# Altium schematic sheet Sheet1.SchDoc
size A2
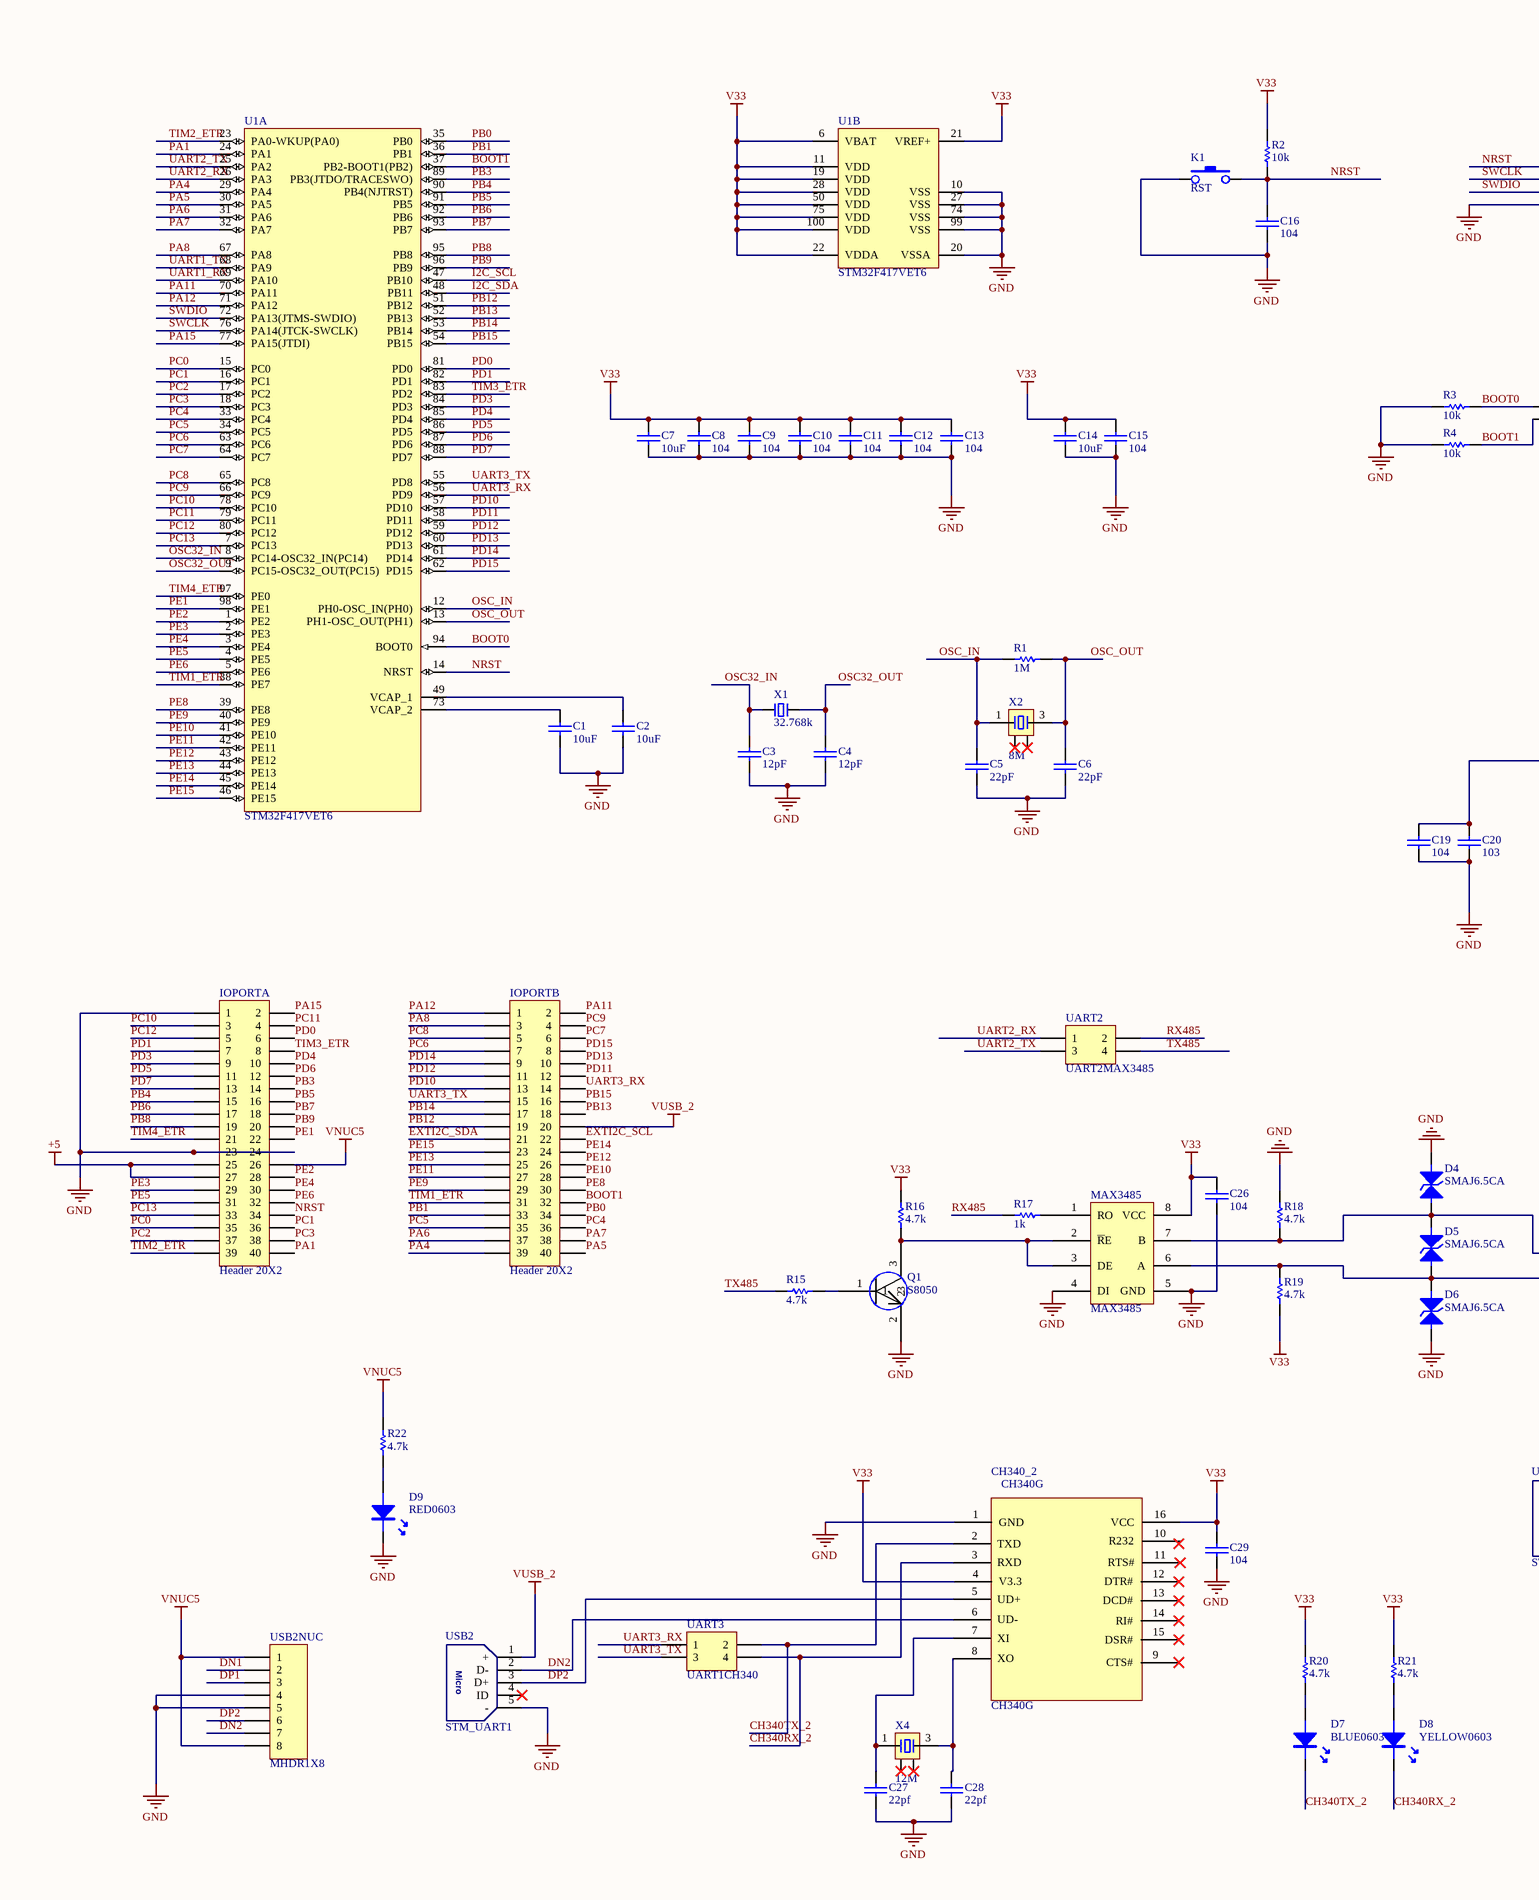
[diagram p0: Sheet1.SchDoc, left]
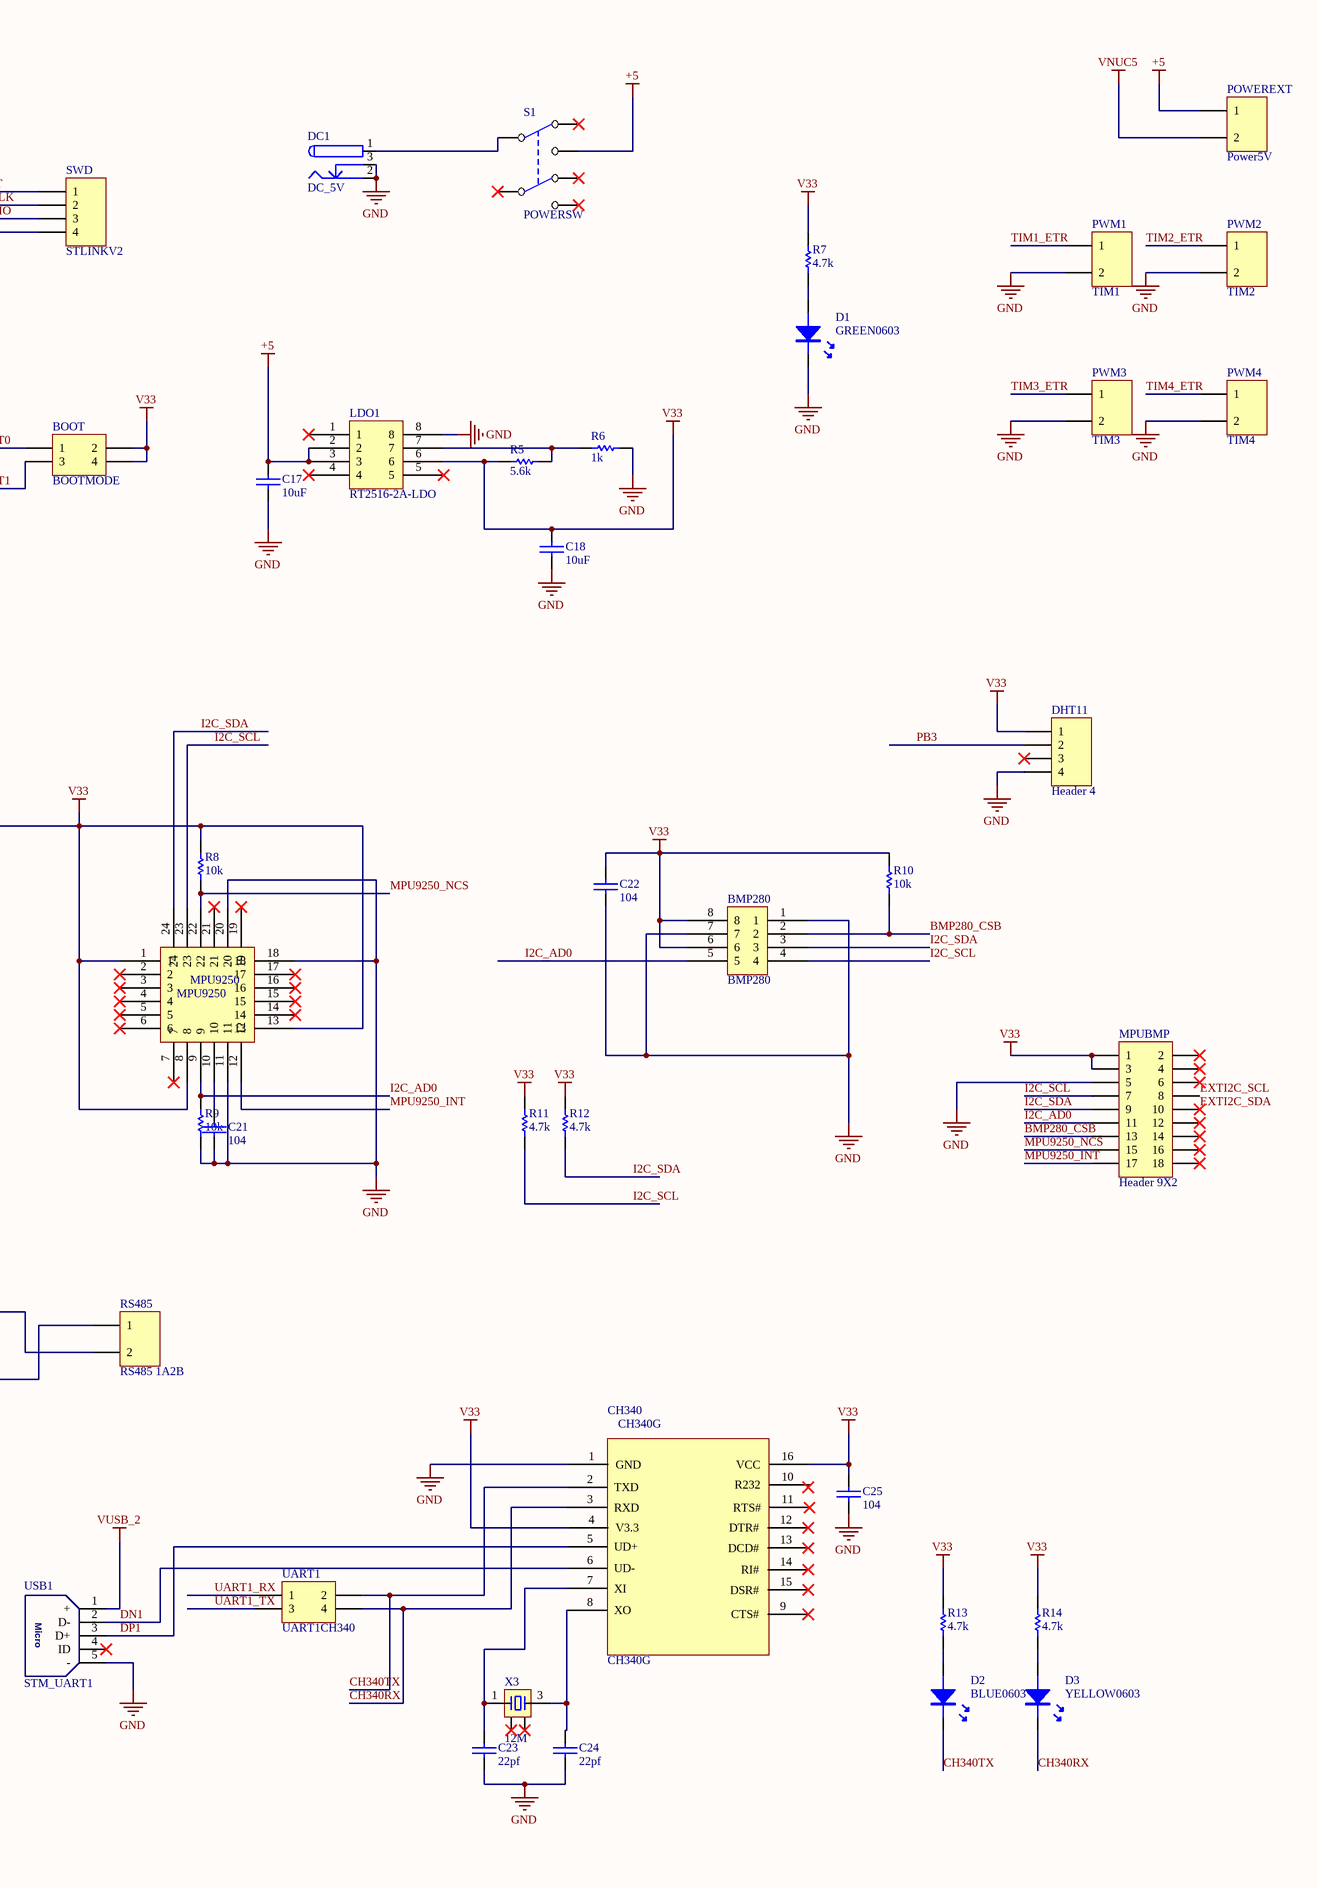
[diagram p1: Sheet1.SchDoc, right]

## Parts
BMP280  BMP280  [LGA8-BOSCH]
BOOT  BOOTMODE  [HDR2X2]
C1  10uF  [0805C]
C2  10uF  [0805C]
C3  12pF  [0603C]
C4  12pF  [0603C]
C5  22pF  [0603C]
C6  22pF  [0603C]
C7  10uF  [0805C]
C8  104  [0603C]
C9  104  [0603C]
C10  104  [0603C]
C11  104  [0603C]
C12  104  [0603C]
C13  104  [0603C]
C14  10uF  [0805C]
C15  104  [0603C]
C16  104  [0603C]
C17  10uF  [0805C]
C18  10uF  [0805C]
C19  104  [0603C]
C20  103  [0603C]
C21  104  [0603C]
C22  104  [0603C]
C23  22pf  [0603C]
C24  22pf  [0603C]
C25  104  [0603C]
C26  104  [0805C]
C27  22pf  [0603C]
C28  22pf  [0603C]
C29  104  [0603C]
CH340  CH340G  [SOIC127P600X170-16N]
CH340_2  CH340G  [SOIC127P600X170-16N]
D1  GREEN0603  [LED-0603G]
D2  BLUE0603  [LED-0603B]
D3  YELLOW0603  [LED-0603Y]
D4  SMAJ6.5CA  [SMA/DO-214AC]
D5  SMAJ6.5CA  [SMA/DO-214AC]
D6  SMAJ6.5CA  [SMA/DO-214AC]
D7  BLUE0603  [LED-0603B]
D8  YELLOW0603  [LED-0603Y]
D9  RED0603  [LED-0603W]
DC1  DC_5V  [DC-050]
DHT11  Header 4  [HDR1X4]
IOPORTA  Header 20X2  [HDR2X20]
IOPORTB  Header 20X2  [HDR2X20]
K1  RST  [DIP-6X6X5]
LDO1  RT2516-2A-LDO  [SOP8]
MAX3485  MAX3485  [SOP8]
MPU9250  MPU9250  [QFN24-9250]
MPUBMP  Header 9X2  [HDR2X9]
POWEREXT  Power5V  [KF301-2P]
PWM1  TIM1  [KF301-2P]
PWM2  TIM2  [KF301-2P]
PWM3  TIM3  [KF301-2P]
PWM4  TIM4  [KF301-2P]
Q1  S8050  [SOT23]
R1  1M  [0603R]
R2  10k  [0603R]
R3  10k  [0603R]
R4  10k  [0603R]
R5  5.6k  [0603R]
R6  1k  [0603R]
R7  4.7k  [0603R]
R8  10k  [0603R]
R9  10k  [0603R]
R10  10k  [0603R]
R11  4.7k  [0603R]
R12  4.7k  [0603R]
R13  4.7k  [0603R]
R14  4.7k  [0603R]
R15  4.7k  [0603R]
R16  4.7k  [0603R]
R17  1k  [0603R]
R18  4.7k  [0603R]
R19  4.7k  [0603R]
R20  4.7k  [0603R]
R21  4.7k  [0603R]
R22  4.7k  [0603R]
RS485  RS485 1A2B  [KF301-2P]
S1  POWERSW  [KFT DIP-7X7]
SWD  STLINKV2  [HDR1X4]
U1  STM32F417VET6  [STM-LQFP100_N]  (parts A,B of 2)
UART1  UART1CH340  [HDR2X2]
UART2  UART2MAX3485  [HDR2X2]
UART3  UART1CH340  [HDR2X2]
USB1  STM_UART1  [USB-micro_B]
USB2  STM_UART1  [USB-micro_B]
USB2NUC  MHDR1X8  [MHDR1X8]
X1  32.768k  [X3215]
X2  8M  [OSC 3225-4P]
X3  12M  [OSC 3225-4P]
X4  12M  [OSC 3225-4P]

## Nets
+5: C17.2 IOPORTA.25 IOPORTA.27 LDO1.2 LDO1.3 POWEREXT.1 S1.1
GND: BMP280.1 BMP280.7 C1.1 C2.1 C3.1 C4.1 C5.1 C6.1 C7.1 C8.1 C9.1 C10.1 C11.1 C12.1 C13.1 C14.1 C15.1 C16.1 C17.1 C18.1 C19.1 C20.1 C21.1 C22.1 C23.1 C24.1 C25.1 C26.1 C27.1 C28.1 C29.1 CH340.1(GND) CH340_2.1(GND) D1.K D4.K D6.A D9.K DC1.2 DC1.3 DHT11.4 IOPORTA.1 IOPORTA.23 IOPORTA.24 K1.1 LDO1.8 MAX3485.4(DI) MAX3485.5(GND) MPU9250.11 MPU9250.18 MPU9250.20 MPUBMP.5 PWM1.2 PWM2.2 PWM3.2 PWM4.2 Q1.2 R3.2 R4.2 R6.2 R9.1 R18.2 SWD.4 U1.10(VSS) U1.20(VSSA) U1.27(VSS) U1.74(VSS) U1.99(VSS) USB1.5(-) USB2.5(-) USB2NUC.4 USB2NUC.5
V33: BMP280.6 BMP280.8 BOOT.2 BOOT.4 C7.2 C8.2 C9.2 C10.2 C11.2 C12.2 C13.2 C14.2 C15.2 C18.2 C19.2 C20.2 C22.2 C25.2 C26.2 C29.2 CH340.4(V3.3) CH340.16(VCC) CH340_2.4(V3.3) CH340_2.16(VCC) DHT11.1 LDO1.6 MAX3485.8(VCC) MPU9250.1 MPU9250.8 MPU9250.13 MPUBMP.1 MPUBMP.3 R2.2 R5.1 R7.2 R8.2 R10.2 R11.2 R12.2 R13.2 R14.2 R16.2 R19.1 R20.2 R21.2 U1.6(VBAT) U1.11(VDD) U1.19(VDD) U1.21(VREF+) U1.22(VDDA) U1.28(VDD) U1.50(VDD) U1.75(VDD) U1.100(VDD)
VNUC5: IOPORTA.26 POWEREXT.2 R22.2 USB2NUC.1 USB2NUC.8
VUSB_2: IOPORTB.20 USB1.1(+) USB2.1(+)
BMP280_CSB: BMP280.2 MPUBMP.13 R10.1
BOOT0: BOOT.1 R3.1 U1.94(BOOT0)
BOOT1: BOOT.3 IOPORTB.32 R4.1 U1.37(PB2-BOOT1(PB2))
CH340RX: CH340.3(RXD) D3.K UART1.4
CH340RX_2: CH340_2.3(RXD) D8.K UART3.4
CH340TX: CH340.2(TXD) D2.K UART1.2
CH340TX_2: CH340_2.2(TXD) D7.K UART3.2
DN1: CH340.6(UD-) USB1.2(D-) USB2NUC.2
DN2: CH340_2.6(UD-) USB2.2(D-) USB2NUC.7
DP1: CH340.5(UD+) USB1.3(D+) USB2NUC.3
DP2: CH340_2.5(UD+) USB2.3(D+) USB2NUC.6
EXTI2C_SCL: IOPORTB.22 MPUBMP.8
EXTI2C_SDA: IOPORTB.21 MPUBMP.10
I2C_AD0: BMP280.5 MPU9250.9 MPUBMP.11 R9.2
I2C_SCL: BMP280.4 MPU9250.23 MPUBMP.7 R11.1 U1.47(PB10)
I2C_SDA: BMP280.3 MPU9250.24 MPUBMP.9 R12.1 U1.48(PB11)
MPU9250_INT: MPU9250.12 MPUBMP.17
MPU9250_NCS: MPU9250.22 MPUBMP.15 R8.1
NRST: C16.2 IOPORTA.34 K1.3 R2.1 SWD.1 U1.14(NRST)
OSC32_IN: C3.2 U1.8(PC14-OSC32_IN(PC14)) X1.2
OSC32_OUT: C4.2 U1.9(PC15-OSC32_OUT(PC15)) X1.1
OSC_IN: C5.2 R1.1 U1.12(PH0-OSC_IN(PH0)) X2.1
OSC_OUT: C6.2 R1.2 U1.13(PH1-OSC_OUT(PH1)) X2.3
PA1: IOPORTA.40 U1.24(PA1)
PA4: IOPORTB.39 U1.29(PA4)
PA5: IOPORTB.40 U1.30(PA5)
PA6: IOPORTB.37 U1.31(PA6)
PA7: IOPORTB.38 U1.32(PA7)
PA8: IOPORTB.3 U1.67(PA8)
PA11: IOPORTB.2 U1.70(PA11)
PA12: IOPORTB.1 U1.71(PA12)
PA15: IOPORTA.2 U1.77(PA15(JTDI))
PB0: IOPORTB.34 U1.35(PB0)
PB1: IOPORTB.33 U1.36(PB1)
PB3: DHT11.2 IOPORTA.14 U1.89(PB3(JTDO/TRACESWO))
PB4: IOPORTA.15 U1.90(PB4(NJTRST))
PB5: IOPORTA.16 U1.91(PB5)
PB6: IOPORTA.17 U1.92(PB6)
PB7: IOPORTA.18 U1.93(PB7)
PB8: IOPORTA.19 U1.95(PB8)
PB9: IOPORTA.20 U1.96(PB9)
PB12: IOPORTB.19 U1.51(PB12)
PB13: IOPORTB.18 U1.52(PB13)
PB14: IOPORTB.17 U1.53(PB14)
PB15: IOPORTB.16 U1.54(PB15)
PC0: IOPORTA.35 U1.15(PC0)
PC1: IOPORTA.36 U1.16(PC1)
PC2: IOPORTA.37 U1.17(PC2)
PC3: IOPORTA.38 U1.18(PC3)
PC4: IOPORTB.36 U1.33(PC4)
PC5: IOPORTB.35 U1.34(PC5)
PC6: IOPORTB.7 U1.63(PC6)
PC7: IOPORTB.6 U1.64(PC7)
PC8: IOPORTB.5 U1.65(PC8)
PC9: IOPORTB.4 U1.66(PC9)
PC10: IOPORTA.3 U1.78(PC10)
PC11: IOPORTA.4 U1.79(PC11)
PC12: IOPORTA.5 U1.80(PC12)
PC13: IOPORTA.33 U1.7(PC13)
PD0: IOPORTA.6 U1.81(PD0)
PD1: IOPORTA.7 U1.82(PD1)
PD3: IOPORTA.9 U1.84(PD3)
PD4: IOPORTA.10 U1.85(PD4)
PD5: IOPORTA.11 U1.86(PD5)
PD6: IOPORTA.12 U1.87(PD6)
PD7: IOPORTA.13 U1.88(PD7)
PD10: IOPORTB.13 U1.57(PD10)
PD11: IOPORTB.12 U1.58(PD11)
PD12: IOPORTB.11 U1.59(PD12)
PD13: IOPORTB.10 U1.60(PD13)
PD14: IOPORTB.9 U1.61(PD14)
PD15: IOPORTB.8 U1.62(PD15)
PE1: IOPORTA.22 U1.98(PE1)
PE2: IOPORTA.28 U1.1(PE2)
PE3: IOPORTA.29 U1.2(PE3)
PE4: IOPORTA.30 U1.3(PE4)
PE5: IOPORTA.31 U1.4(PE5)
PE6: IOPORTA.32 U1.5(PE6)
PE8: IOPORTB.30 U1.39(PE8)
PE9: IOPORTB.29 U1.40(PE9)
PE10: IOPORTB.28 U1.41(PE10)
PE11: IOPORTB.27 U1.42(PE11)
PE12: IOPORTB.26 U1.43(PE12)
PE13: IOPORTB.25 U1.44(PE13)
PE14: IOPORTB.24 U1.45(PE14)
PE15: IOPORTB.23 U1.46(PE15)
RX485: R17.1 UART2.2
SWCLK: SWD.2 U1.76(PA14(JTCK-SWCLK))
SWDIO: SWD.3 U1.72(PA13(JTMS-SWDIO))
TIM1_ETR: IOPORTB.31 PWM1.1 U1.38(PE7)
TIM2_ETR: IOPORTA.39 PWM2.1 U1.23(PA0-WKUP(PA0))
TIM3_ETR: IOPORTA.8 PWM3.1 U1.83(PD2)
TIM4_ETR: IOPORTA.21 PWM4.1 U1.97(PE0)
TX485: R15.1 UART2.4
UART1_RX: U1.69(PA10) UART1.1
UART1_TX: U1.68(PA9) UART1.3
UART2_RX: U1.26(PA3) UART2.1
UART2_TX: U1.25(PA2) UART2.3
UART3_RX: IOPORTB.14 U1.56(PD9) UART3.1
UART3_TX: IOPORTB.15 U1.55(PD8) UART3.3
NetC1_2: C1.2 U1.73(VCAP_2)
NetC2_2: C2.2 U1.49(VCAP_1)
NetC21_2: C21.2 MPU9250.10
NetC23_2: C23.2 CH340.7(XI) X3.1
NetC24_2: C24.2 CH340.8(XO) X3.3
NetC27_2: C27.2 CH340_2.7(XI) X4.1
NetC28_2: C28.2 CH340_2.8(XO) X4.3
NetD1_A: D1.A R7.1
NetD2_A: D2.A R13.1
NetD3_A: D3.A R14.1
NetD4_A: D4.A D5.K MAX3485.7(B) R18.1 RS485.2
NetD5_A: D5.A D6.K MAX3485.6(A) R19.2 RS485.1
NetD7_A: D7.A R20.1
NetD8_A: D8.A R21.1
NetD9_A: D9.A R22.1
NetDC1_1: DC1.1 S1.2
NetLDO1_7: LDO1.7 R5.2 R6.1
NetMAX3485_1: MAX3485.1(RO) R17.2
NetMAX3485_2: MAX3485.2(~{R}E) MAX3485.3(DE) Q1.3 R16.1
NetQ1_1: Q1.1 R15.2

Not connected (* = marked no-connect by the designer): CH340 9(CTS#)* 10(R232) 11(RTS#)* 12(DTR#)* 13(DCD#)* 14(RI#)* 15(DSR#)*; CH340_2 9(CTS#)* 10(R232) 11(RTS#)* 12(DTR#)* 13(DCD#)* 14(RI#)* 15(DSR#)*; DHT11 3*; LDO1 1* 4* 5*; MPU9250 2* 3* 4* 5* 6* 7* 14* 15* 16* 17* 19* 21*; MPUBMP 2* 4* 6* 12* 14* 16* 18*; S1 3* 4* 5* 6*; USB1 4(ID)*; USB2 4(ID)*; X2 2* 4*; X3 2* 4*; X4 2* 4*

## Notes on the sheet
- (in symbol Micro-USB) Micro

## Library data of the parts
BMP280 = LGA8-BOSCH
BOOT UART1-UART3 = Header 2X2: Header, 2-Pin, Dual row; LatestRevisionDate: 17-Jul-2002; LatestRevisionNote: Re-released for DXP Platform.; Publisher: Altium Limited
C1-C29 = CAP: 无极性电容
CH340 CH340_2 = Component_1
D1-D3 D7-D9 = LED
D4-D6 = TVS: 双向瞬态抑制二极管
DC1 = DC_Socket
DHT11 SWD = Header 4: Header, 4-Pin; LatestRevisionDate: 17-Jul-2002; LatestRevisionNote: Re-released for DXP Platform.; Publisher: Altium Limited
IOPORTA IOPORTB = Header 20X2: Header, 20-Pin, Dual row; LatestRevisionDate: 17-Jul-2002; LatestRevisionNote: Re-released for DXP Platform.; Publisher: Altium Limited
K1 = KEY
LDO1 = RT2516
MAX3485 = MAX481
MPU9250 = QFN24
MPUBMP = Header 9X2: Header, 9-Pin, Dual row; LatestRevisionDate: 17-Jul-2002; LatestRevisionNote: Re-released for DXP Platform.; Publisher: Altium Limited
POWEREXT PWM1-PWM4 RS485 = Connector-2P
Q1 = S9014
R1-R22 = RES
S1 = KFT DIP-7X7
U1 = STM32F417VET6: ARM Cortex-M4 32-bit MCU+FPU, 210 DMIPS, 512 kB Flash, 192 kB Internal RAM, 82 I/Os, 100-pin LQFP, -40 to 85 degC, Tray; Manufacturer: STMicroelectronics; D/A Converter: 2x12-bit; FLASH Size (Prog) (kB): 512; I/Os (High Current): 82; Internal RAM Size (kB): 192; Operating Frequency(F) (Processor speed) (MHz): 168; Supply Voltage(Vcc) max (V): 3.6; Supply Voltage(Vcc) min (V): 1.8; DatasheetVersion: Rev. 4; PackageVersion: Rev. 1, 06/2013; PackageReference: LQFP100; PackageDescription: 100-Pin Low Profile Quad Flat Package, 14 x 14 mm Body, 0.5 mm Pitch; Supplier 1: Digi-Key; Supplier Part Number 1: 497-11901-ND; Supplier 2: Farnell; Supplier Part Number 2: 2333307; Supplier 3: Newark; Supplier Part Number 3: 99W9922; Supplier 4: Newark; Supplier Part Number 4: 94T6496; Supplier 5: Mouser; Supplier Part Number 5: 511-STM32F417VET6; Core: ARM Cortex-M4; Packing: Tray; Mounting Technology: Surface Mount; PartNumber: STM32F417VET6; ComponentLink1Description: Manufacturer URL; ComponentLink1URL: http://www.st.com/web/en/home.html; ComponentLink2Description: Datasheet; ComponentLink2URL: http://www.st.com/st-web-ui/static/active/en/resource/technical/document/datasheet/DM00035129.pdf; ComponentLink3Description: Package Specification; ComponentLink3URL: http://www.st.com/st-web-ui/static/active/en/resource/technical/document/data_brief/DM00071938.pdf
USB1 USB2 = Micro-USB
USB2NUC = MHDR1X8: Header, 8-Pin; LatestRevisionDate: 17-Jul-2002; LatestRevisionNote: Re-released for DXP Platform.; Publisher: Altium Limited
X1 = XTAL-2P: 2脚无源脚晶振
X2-X4 = XTAL-4P: 4脚无源晶振